# EasyEDA Pro project CCD传感器驱动板_DAC8311_ADS1118.eprj, schematic schematic1

## Sheets
1 power source: Create Date: 2025-03-25; Page Name: power source; Project Name: CCD传感器驱动板_DAC8311_ADS1118; Schematic Name: schematic1; Update Date: 2025-03-25; Company: 嘉立创EDA; Page Size: A4; Version: V1.0
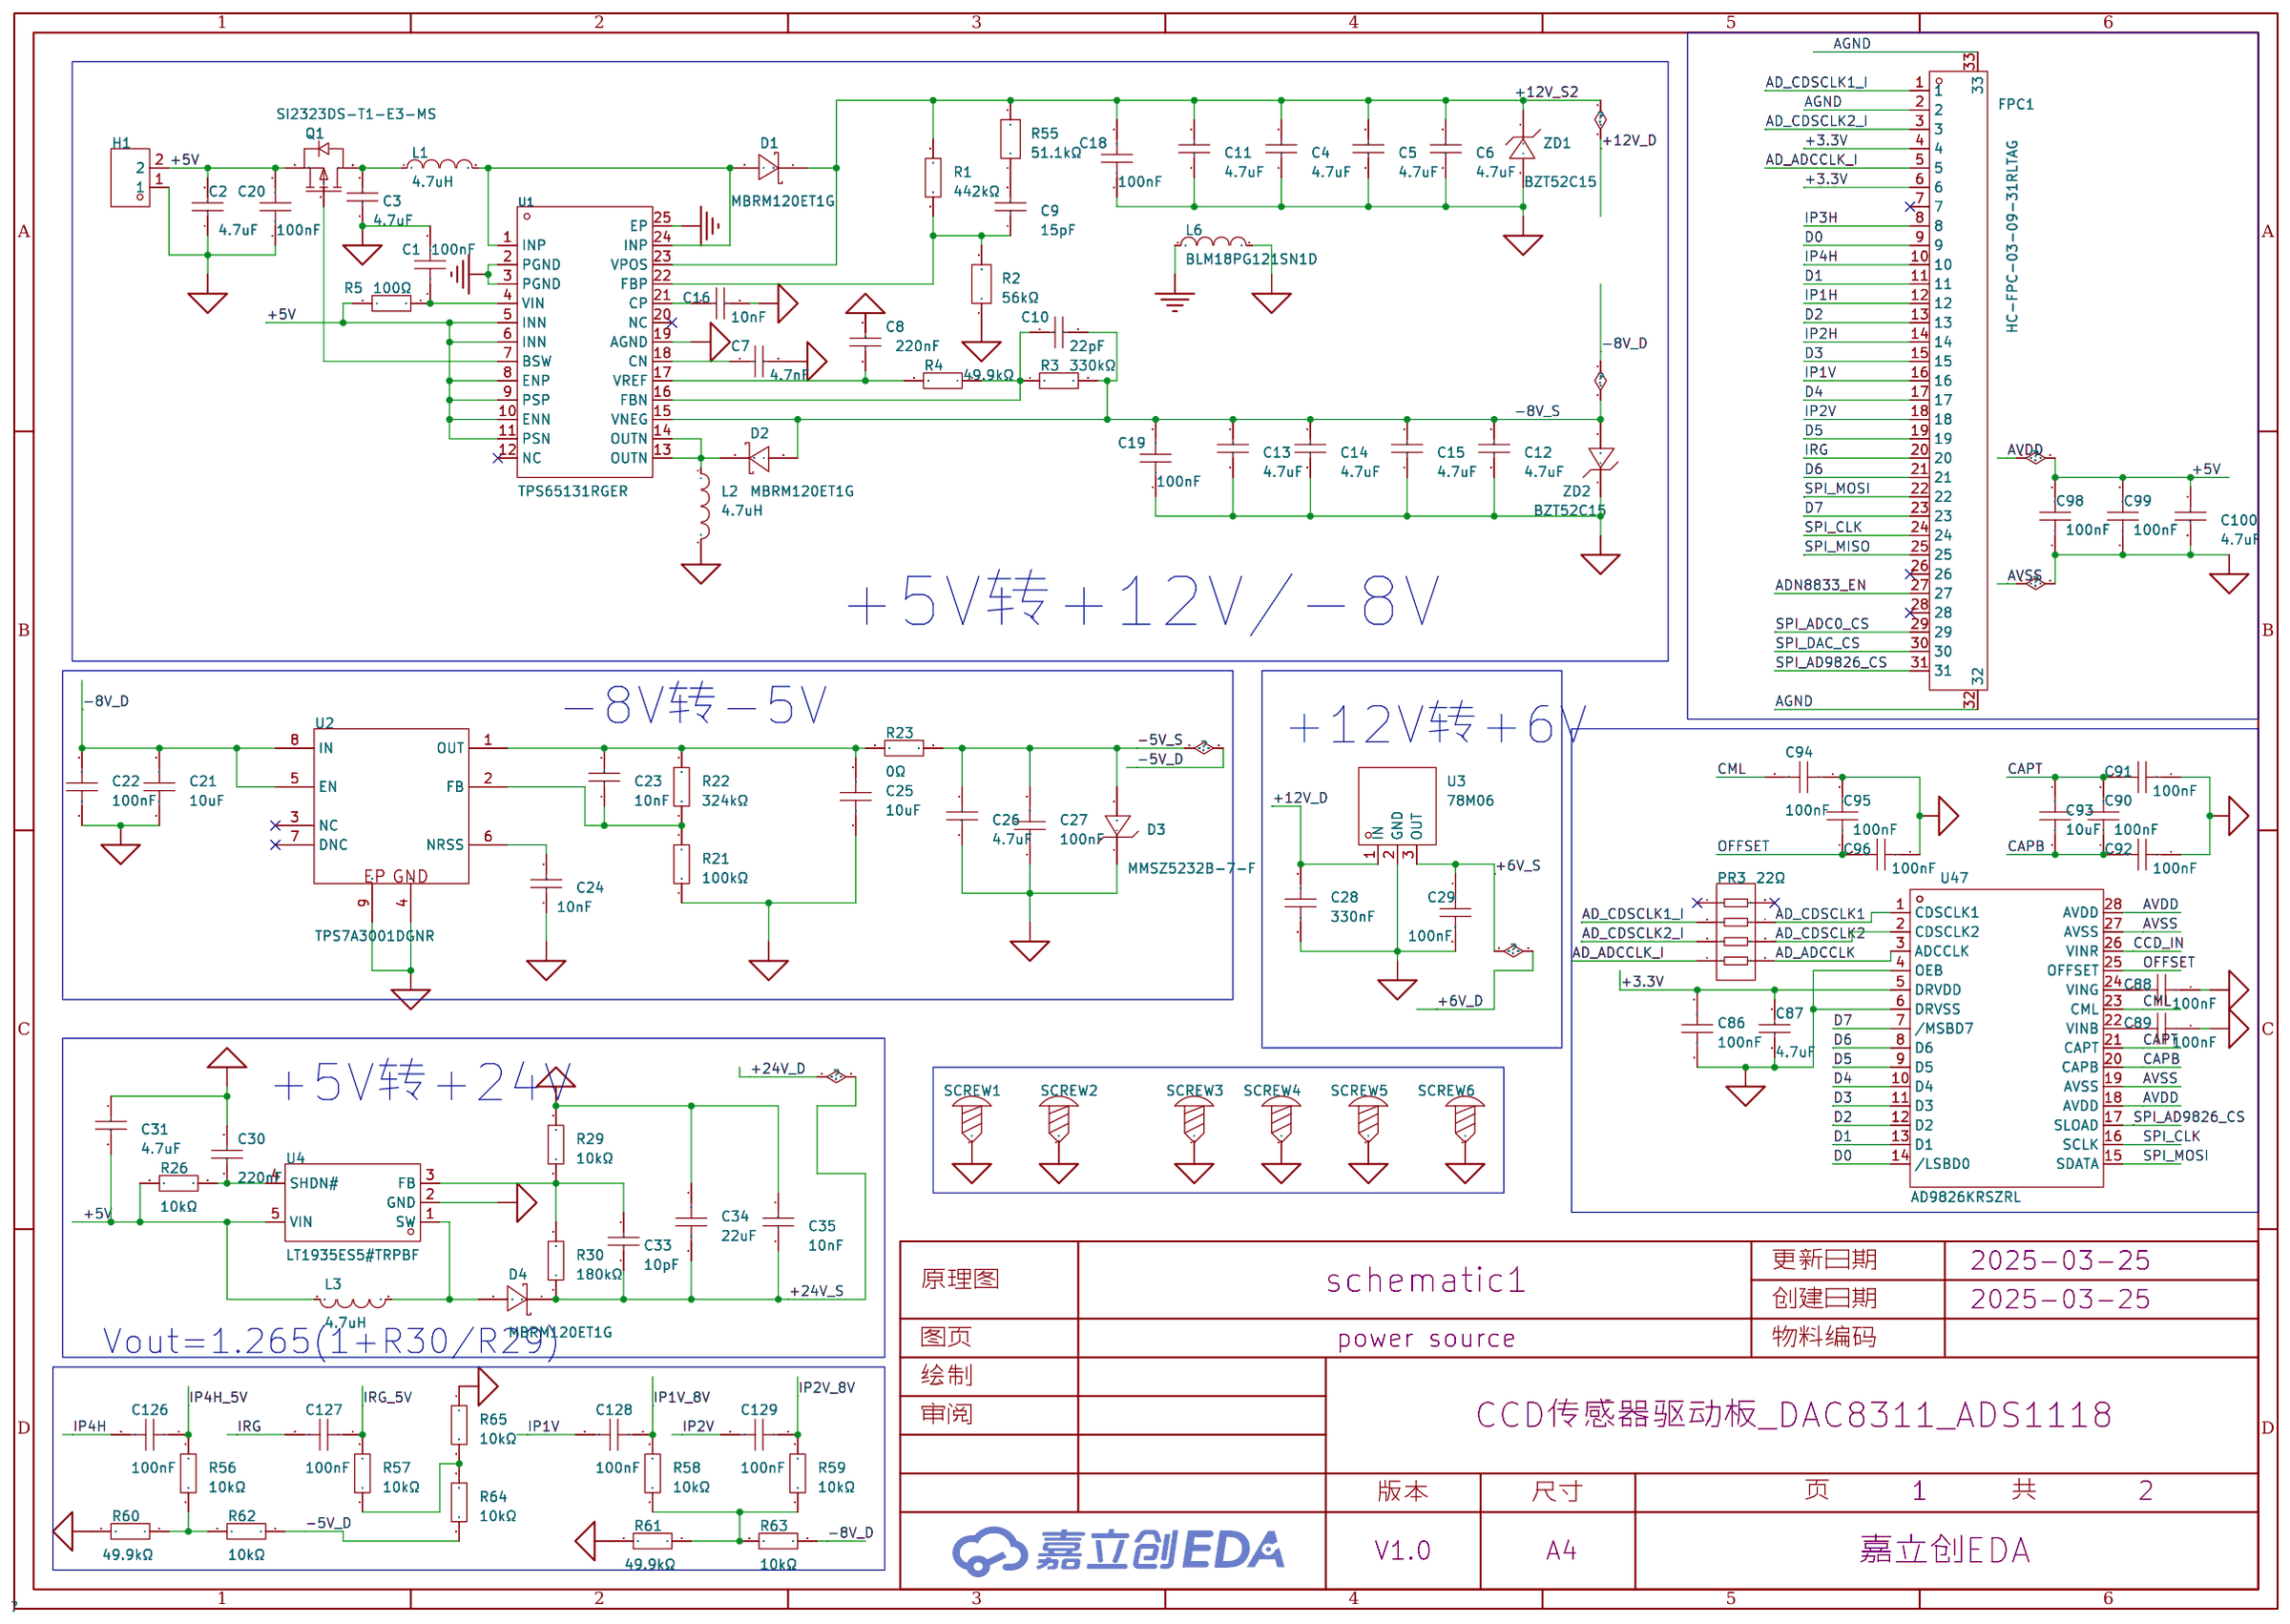
[diagram p0: power source]
2 electric convert: Page Name: electric convert; Update Date: 2025-03-26
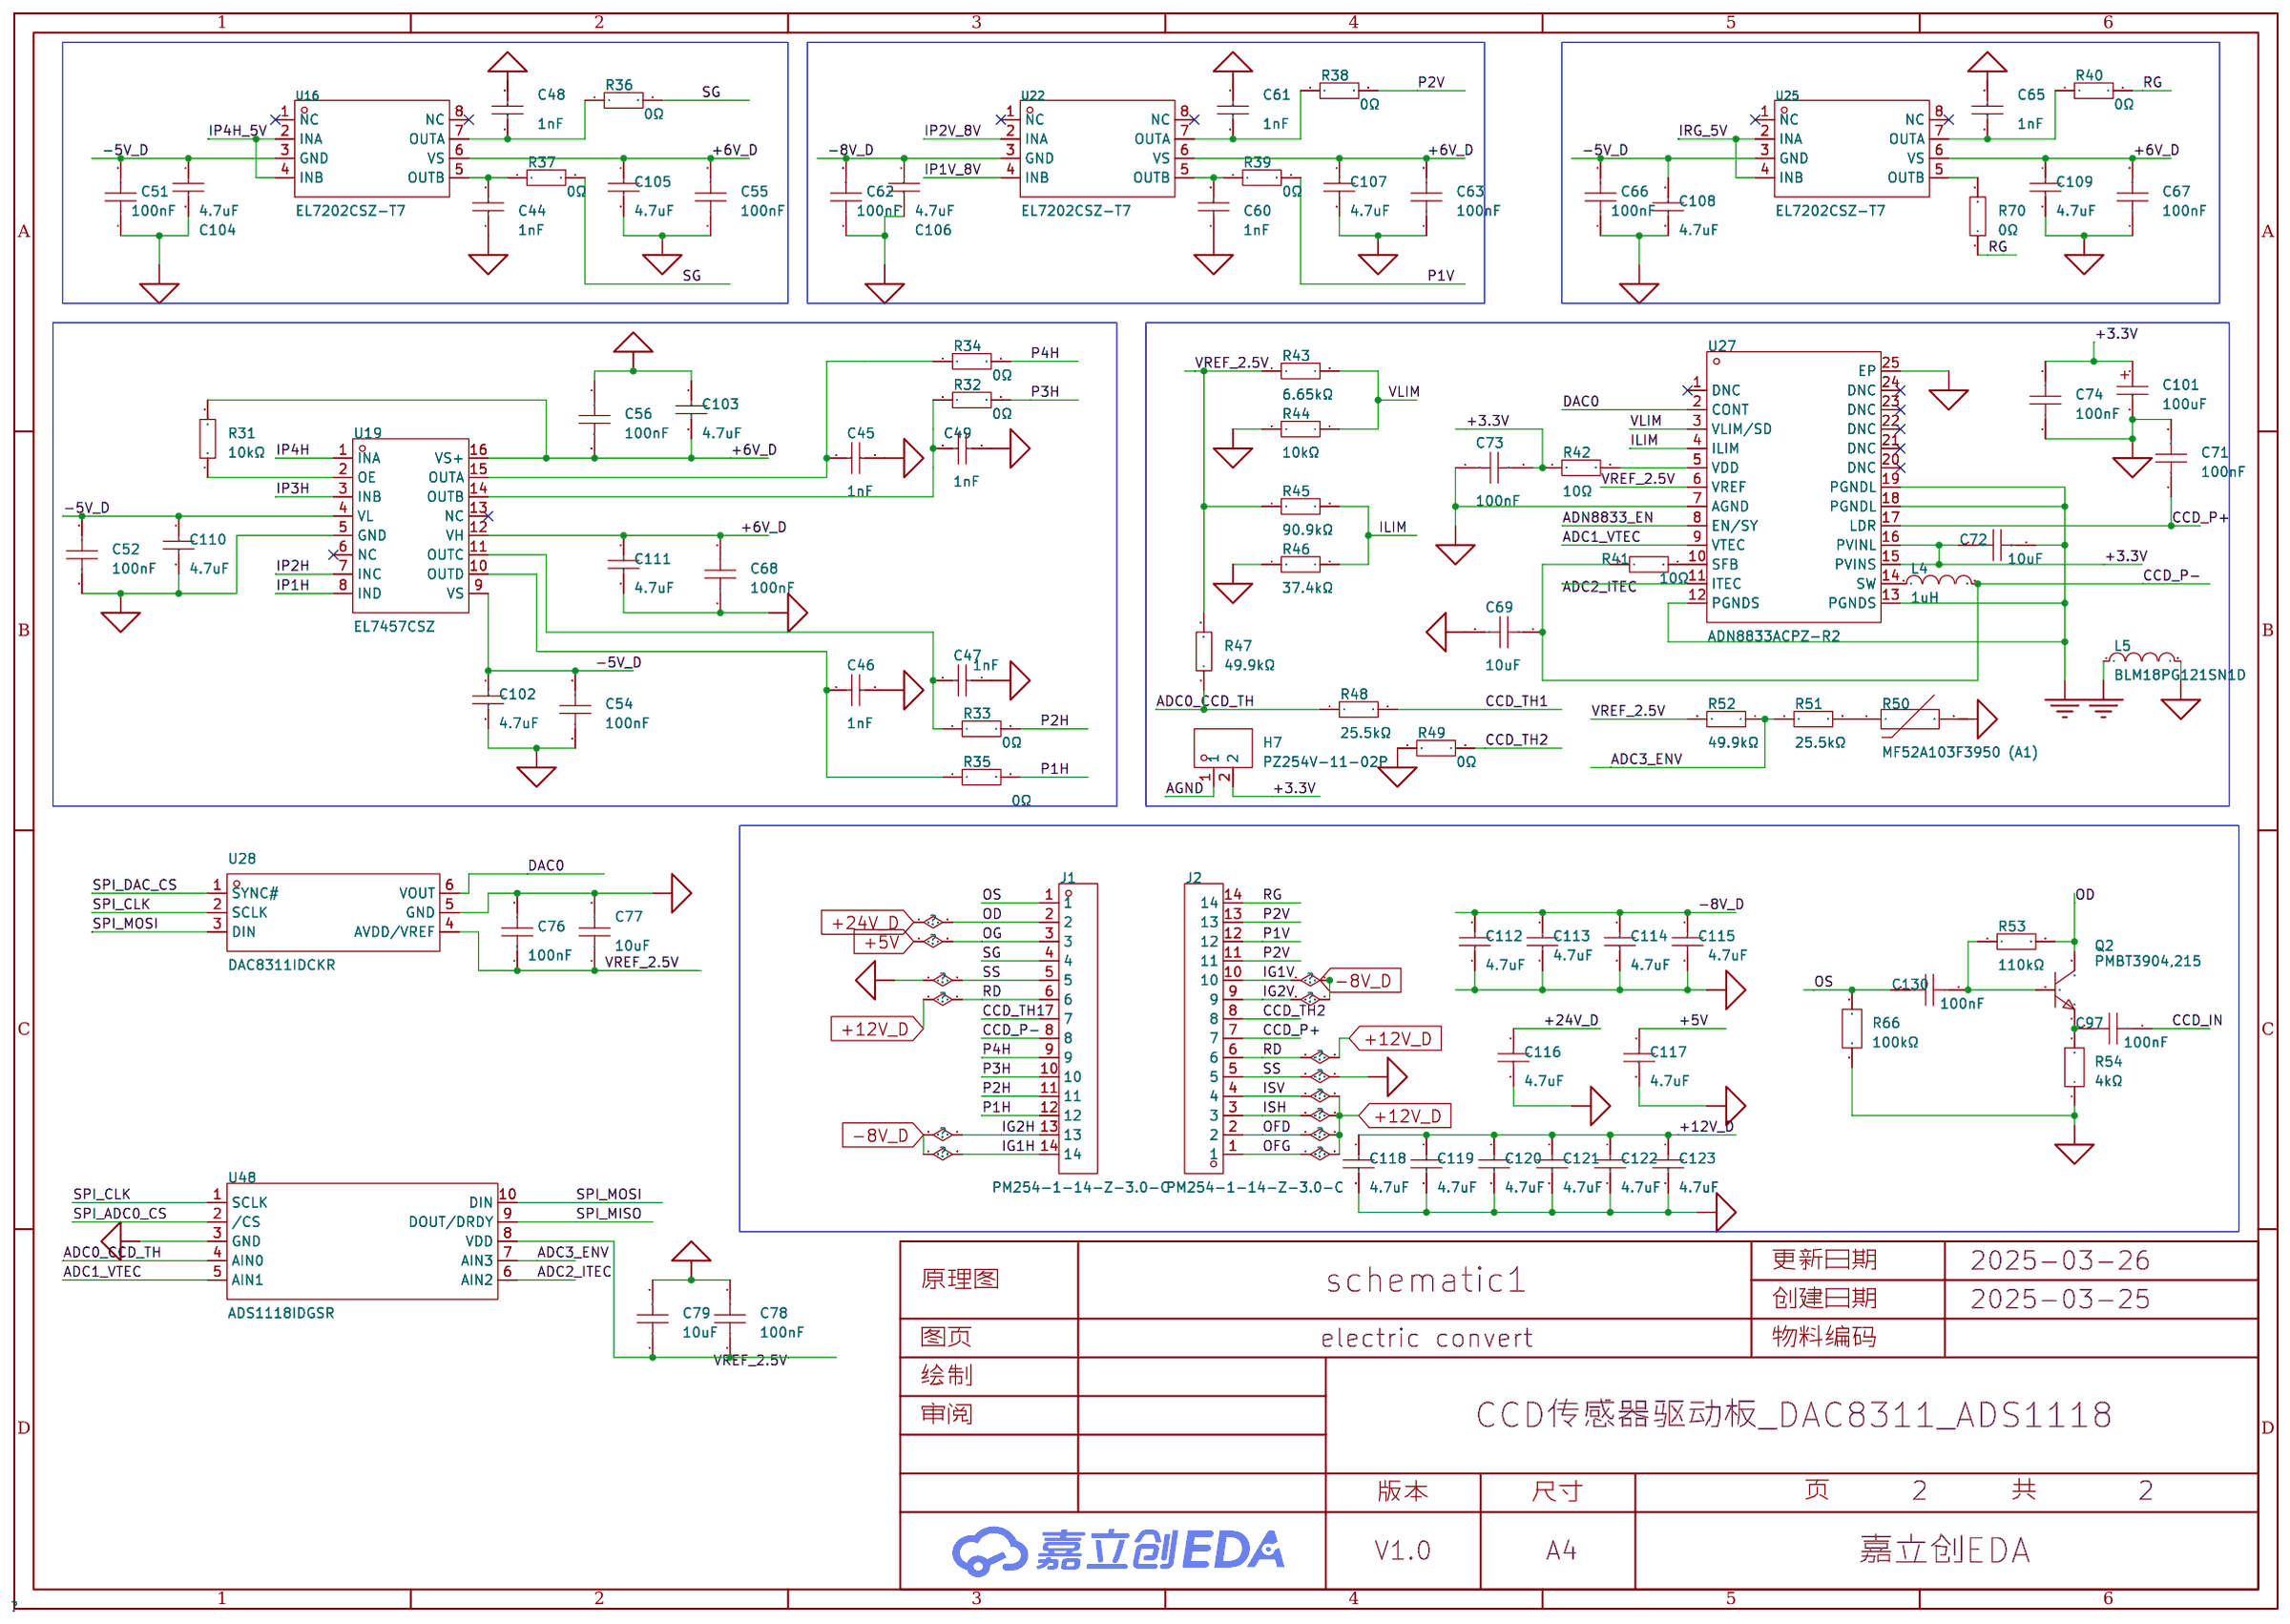
[diagram p1: electric convert]

## Parts
sheet electric convert
C44  1nF  [C0603]
C45  1nF  [C0603]
C46  1nF  [C0603]
C47  1nF  [C0603]
C48  1nF  [C0603]
C49  1nF  [C0603]
C51  100nF  [C0603]
C52  100nF  [C0603]
C54  100nF  [C0603]
C55  100nF  [C0603]
C56  100nF  [C0603]
C60  1nF  [C0603]
C61  1nF  [C0603]
C62  100nF  [C0603]
C63  100nF  [C0603]
C65  1nF  [C0603]
C66  100nF  [C0603]
C67  100nF  [C0603]
C68  100nF  [C0603]
C69  10uF  [C0603]
C71  100nF  [C0603]
C72  10uF  [C0603]
C73  100nF  [C0603]
C74  100nF  [C0603]
C76  100nF  [C0603]
C77  10uF  [C0603]
C78  100nF  [C0603]
C79  10uF  [C0603]
C97  100nF  [C0603]
C101  100uF  [CASE-B_3528]
C102  4.7uF  [C0603]
C103  4.7uF  [C0603]
C104  4.7uF  [C0603]
C105  4.7uF  [C0603]
C106  4.7uF  [C0603]
C107  4.7uF  [C0603]
C108  4.7uF  [C0603]
C109  4.7uF  [C0603]
C110  4.7uF  [C0603]
C111  4.7uF  [C0603]
C112  4.7uF  [C0603]
C113  4.7uF  [C0603]
C114  4.7uF  [C0603]
C115  4.7uF  [C0603]
C116  4.7uF  [C0603]
C117  4.7uF  [C0603]
C118  4.7uF  [C0603]
C119  4.7uF  [C0603]
C120  4.7uF  [C0603]
C121  4.7uF  [C0603]
C122  4.7uF  [C0603]
C123  4.7uF  [C0603]
C130  100nF  [C0603]
H7  PZ254V-11-02P  [HDR-TH_2P-P2.54-V-M]
J1  PM254-1-14-Z-3.0-C  [HDR-TH_14P-P2.54-V-F]
J2  PM254-1-14-Z-3.0-C  [HDR-TH_14P-P2.54-V-F]
L4  1uH  [L0603]
L5  BLM18PG121SN1D  [L0603]
Q2  PMBT3904,215  [SOT-23_L2.9-W1.3-P1.90-LS2.4-BR]
R31  10kΩ  [R0603]
R32  0Ω  [R0603]
R33  0Ω  [R0603]
R34  0Ω  [R0603]
R35  0Ω  [R0603]
R36  0Ω  [R0603]
R37  0Ω  [R0603]
R38  0Ω  [R0603]
R39  0Ω  [R0603]
R40  0Ω  [R0603]
R41  10Ω  [R0603]
R42  10Ω  [R0603]
R43  6.65kΩ  [R0603]
R44  10kΩ  [R0603]
R45  90.9kΩ  [R0603]
R46  37.4kΩ  [R0603]
R47  49.9kΩ  [R0603]
R48  25.5kΩ  [R0603]
R49  0Ω  [R0603]
R50  MF52A103F3950 (A1)  [RES-TH_L2.5-W2.5-P1.70-D0.3]
R51  25.5kΩ  [R0603]
R52  49.9kΩ  [R0603]
R53  110kΩ  [R0603]
R54  4kΩ  [R0603]
R66  100kΩ  [R0603]
R70  0Ω  [R0603]
U16  EL7202CSZ-T7  [SOIC-8_L4.9-W3.9-P1.27-LS6.0-BL]
U19  EL7457CSZ  [SOIC-16_L9.9-W3.9-P1.27-LS6.0-BL]
U22  EL7202CSZ-T7  [SOIC-8_L4.9-W3.9-P1.27-LS6.0-BL]
U25  EL7202CSZ-T7  [SOIC-8_L4.9-W3.9-P1.27-LS6.0-BL]
U27  ADN8833ACPZ-R2  [LFCSP-24_L4.0-W4.0-P0.50-BL-EP2.7]
U28  DAC8311IDCKR  [SC-70-6_L2.0-W1.3-P0.65-LS2.2-BL]
U48  ADS1118IDGSR  [VSSOP-10_L3.0-W3.0-P0.50-LS4.9-BL]
sheet power source
C1  100nF  [C0603]
C2  4.7uF  [C0603]
C3  4.7uF  [C0603]
C4  4.7uF  [C0603]
C5  4.7uF  [C0603]
C6  4.7uF  [C0603]
C7  4.7nF  [C0603]
C8  220nF  [C0603]
C9  15pF  [C0603]
C10  22pF  [C0603]
C11  4.7uF  [C0603]
C12  4.7uF  [C0603]
C13  4.7uF  [C0603]
C14  4.7uF  [C0603]
C15  4.7uF  [C0603]
C16  10nF  [C0603]
C18  100nF  [C0603]
C19  100nF  [C0603]
C20  100nF  [C0603]
C21  10uF  [C0603]
C22  100nF  [C0603]
C23  10nF  [C0603]
C24  10nF  [C0603]
C25  10uF  [C0603]
C26  4.7uF  [C0603]
C27  100nF  [C0603]
C28  330nF  [C0603]
C29  100nF  [C0603]
C30  220nF  [C0603]
C31  4.7uF  [C0603]
C33  10pF  [C0603]
C34  22uF  [C0603]
C35  10nF  [C0603]
C86  100nF  [C0603]
C87  4.7uF  [C0603]
C88  100nF  [C0603]
C89  100nF  [C0603]
C90  100nF  [C0603]
C91  100nF  [C0603]
C92  100nF  [C0603]
C93  10uF  [C0603]
C94  100nF  [C0603]
C95  100nF  [C0603]
C96  100nF  [C0603]
C98  100nF  [C0603]
C99  100nF  [C0603]
C100  4.7uF  [C0603]
C126  100nF  [C0603]
C127  100nF  [C0603]
C128  100nF  [C0603]
C129  100nF  [C0603]
D1  MBRM120ET1G  [POWERMITE_L2.0-W1.9-LS3.8-RD]
D2  MBRM120ET1G  [POWERMITE_L2.0-W1.9-LS3.8-RD]
D3  MMSZ5232B-7-F  [SOD-123_L2.8-W1.8-LS3.7-RD]
D4  MBRM120ET1G  [POWERMITE_L2.0-W1.9-LS3.8-RD]
FPC1  HC-FPC-03-09-31RLTAG  [FPC-SMD_31P-P0.30_HC-FPC-03-09-31RLTAG]
H1  PZ254V-11-02P  [HDR-TH_2P-P2.54-V-M]
L1  4.7uH  [IND-SMD_L5.5-W5.2]
L2  4.7uH  [IND-SMD_L5.5-W5.2]
L3  4.7uH  [IND-SMD_L5.5-W5.2]
L6  BLM18PG121SN1D  [L0603]
PR3  22Ω  [RES-ARRAY-SMD_0603-8P-L3.2-W1.6-BL]
Q1  SI2323DS-T1-E3-MS  [SOT-23-3_L2.9-W1.3-P1.90-LS2.4-BR]
R1  442kΩ  [R0603]
R2  56kΩ  [R0603]
R3  330kΩ  [R0603]
R4  49.9kΩ  [R0603]
R5  100Ω  [R0603]
R21  100kΩ  [R0603]
R22  324kΩ  [R0603]
R23  0Ω  [R0603]
R26  10kΩ  [R0603]
R29  10kΩ  [R0603]
R30  180kΩ  [R0603]
R55  51.1kΩ  [R0603]
R56  10kΩ  [R0603]
R57  10kΩ  [R0603]
R58  10kΩ  [R0603]
R59  10kΩ  [R0603]
R60  49.9kΩ  [R0603]
R61  49.9kΩ  [R0603]
R62  10kΩ  [R0603]
R63  10kΩ  [R0603]
R64  10kΩ  [R0603]
R65  10kΩ  [R0603]
SCREW1  -  [M2螺丝]
SCREW2  -  [M2螺丝]
SCREW3  -  [M3螺丝]
SCREW4  -  [M3螺丝]
SCREW5  -  [M3螺丝]
SCREW6  -  [M3螺丝]
U1  TPS65131RGER  [QFN-24_L4.0-W4.0-P0.50-TL-EP2.6]
U2  TPS7A3001DGNR  [HVSSOP-8_L3.0-W3.0-P0.65-LS4.9-BL-EP_1]
U3  78M06  [TO-252-3_L6.5-W5.8-P4.58-BL]
U4  LT1935ES5#TRPBF  [TSOT-23-5_L2.9-W1.6-P0.95-LS2.8-BR]
U47  AD9826KRSZRL  [SSOP-28_L10.2-W5.3-P0.65-LS7.8-BL]
ZD1  BZT52C15  [SOD-123_L2.8-W1.8-LS3.7-RD]
ZD2  BZT52C15  [SOD-123_L2.8-W1.8-LS3.7-RD]

## Library data of the parts
C44-C49 C60 C61 C65 = CL10B102KB8NNNC: 容值:1nF;精度:±10%;额定电压:50V;材质(温度系数):X7R;; LCSC Part Name: 1nF ±10% 50V; Supplier Part: C1588; Manufacturer: SAMSUNG(三星); Supplier Footprint: 0603; JLCPCB Part Class: 基础库; Datasheet: https://atta.szlcsc.com/upload/public/pdf/source/20160218/1457707763339.pdf; Supplier: LCSC; Tolerance: ±10%; Voltage Rated: 50V; Temperature Coefficient: X7R
C1 C18-C20 C22 C27 C29 C51 C52 C54-C56 C62 C63 C66-C68 C71 C73 C74 C76 C78 C86 C88-C92 C94-C99 C126-C130 = CL10B104KB8NNNC: 容值:100nF;精度:±10%;额定电压:50V;材质(温度系数):X7R;; LCSC Part Name: 100nF ±10% 50V; Supplier Part: C1591; Manufacturer: SAMSUNG(三星); Supplier Footprint: 0603; JLCPCB Part Class: 扩展库; Datasheet: https://atta.szlcsc.com/upload/public/pdf/source/20160218/1457707763339.pdf; Supplier: LCSC; Tolerance: ±10%; Voltage Rated: 50V; Temperature Coefficient: X7R
C21 C25 C69 C72 C77 C79 C93 = CL10A106MP8NNNC: 容值:10uF;精度:±20%;额定电压:10V;材质(温度系数):X5R;; LCSC Part Name: 10uF ±20% 10V; Supplier Part: C85713; Manufacturer: SAMSUNG(三星); Supplier Footprint: 0603; JLCPCB Part Class: 扩展库; Datasheet: https://atta.szlcsc.com/upload/public/pdf/source/20160218/1457707763339.pdf; Supplier: LCSC; Tolerance: ±20%; Voltage Rated: 10V; Temperature Coefficient: X5R
C101 = TAJB107K006RNJ: 容值:100uF;精度:±10%;额定电压:6.3V;等效串联电阻:1.7Ω@100kHz;; LCSC Part Name: 100uF ±10% 6.3V; Supplier Part: C16133; Manufacturer: Kyocera AVX; Supplier Footprint: CASE-B-3528-21(mm); JLCPCB Part Class: 基础库; Datasheet: https://atta.szlcsc.com/upload/public/pdf/source/20160107/1457707750344.pdf; Supplier: LCSC; Tolerance: ±10%; Rated Voltage: 6.3V; Equivalent Series Resistance(ESR): 1.7Ω@100kHz; Operating Temperature: -55℃~+125℃
C2-C6 C11-C15 C26 C31 C87 C100 C102-C123 = CL10A475KO8NNNC: 容值:4.7uF;精度:±10%;额定电压:16V;材质(温度系数):X5R;; LCSC Part Name: 4.7uF ±10% 16V; Supplier Part: C19666; Manufacturer: SAMSUNG(三星); Supplier Footprint: 0603; JLCPCB Part Class: 基础库; Datasheet: https://atta.szlcsc.com/upload/public/pdf/source/20160218/1457707763339.pdf; Supplier: LCSC; Tolerance: ±10%; Voltage Rated: 16V; Temperature Coefficient: X5R
H1 H7 = PZ254V-11-02P: 插针结构:1x2P;间距:2.54mm;行距:-;圆针/方针:方针;安装类型:直插;排数:单排;总PIN位数:2P;额定电流:-;额定电压:-;配合针长度:6mm;塑高:2.5mm;端接针长度:3mm;触头材质:黄铜;触头镀层:-;工作温度范围:-40℃~+105℃;颜色:黑色;; LCSC Part Name: 间距:2.54mm 1x2P 直插 方针; Supplier Part: C492401; Manufacturer: XFCN(兴飞); Supplier Footprint: 插件,P=2.54mm; JLCPCB Part Class: 扩展库; Datasheet: https://atta.szlcsc.com/upload/public/pdf/source/20200309/C492401_A812433581A9B211A7FFA413ADDFF0E5.pdf; Supplier: LCSC; Pin Structure: 1x2P; Pitch: 2.54mm; Circluar Pins/Square Pins: 方针; Mounting Type: 直插; Number of Rows: 单排; Number of Pins: 2P; Length of Mating Pin: 6mm; Insulation Height: 2.5mm; Length of End Connection Pin: 3mm; Contact Material: 黄铜; Operating Temperature Range: -40℃~+105℃; Color: 黑色
J1 J2 = PM254-1-14-Z-3.0-C: 插孔结构:1x14P;间距:2.54mm;行距:-;圆孔/方孔:圆孔;安装类型:直插;排数:单排;总孔位数:14P;额定电流:3A;插孔方向:顶部;塑高:3mm;触头材质:黄铜;触头镀层:金;工作温度范围:-40℃~+105℃;焊接温度(最大值):260℃@10S;; LCSC Part Name: 1x14P 间距:2.54mm 直插; Supplier Part: C5156452; Manufacturer: HCTL(华灿天禄); Supplier Footprint: 插件,P=2.54mm; Datasheet: https://atta.szlcsc.com/upload/public/pdf/source/20230609/3F35CA450E3E74609FC35AAE8B198FCB.pdf; Supplier: LCSC; Holes Structure: 1x14P; Pitch: 2.54mm; Circular Hole / Square Hole: 圆孔; Mounting Type: 直插; Number of Rows: 单排; Number of Holes: 14P; Current Rating (Max): 3A; Holes Direction: 顶部; Insulation Height: 3mm; Contact Material: 黄铜; Contact Plating: 金; Operating Temperature Range: -40℃~+105℃; Soldering Temperature(Max): 260℃@10S
L4 = LQM18PN1R0MFRL: 电感值:1uH;精度:±20%;额定电流:950mA;饱和电流(Isat):-;直流电阻(DCR):200mΩ;; LCSC Part Name: 1uH ±20%; Supplier Part: C307603; Manufacturer: muRata(村田); Supplier Footprint: 0603; JLCPCB Part Class: 扩展库; Datasheet: https://atta.szlcsc.com/upload/public/pdf/source/20181116/C307603_C4EDA09A2B1B4899E599C63ECAEC2B9D.pdf; Supplier: LCSC; Tolerance: ±20%; Rated Current: 950mA; DC Resistance (DCR): 200mΩ; Frequency - Self Resonant: 100MHz
L5 L6 = BLM18PG121SN1D: 标称阻抗@测试频率:120Ω@100MHz;误差:±25%;直流电阻(RDC):50mΩ;; LCSC Part Name: 单路 0603磁珠 阻抗120Ω@100MHz; Supplier Part: C14709; Manufacturer: muRata(村田); Supplier Footprint: 0603; JLCPCB Part Class: 扩展库; Datasheet: https://atta.szlcsc.com/upload/public/pdf/source/20130704/1457706621422.pdf; Supplier: LCSC; Impedance @ Frequency: 120Ω@100MHz; Tolerance: ±25%; DC Resistance: 50mΩ; Current Rating: 2A; Circuits: 1
Q2 = PMBT3904,215: 晶体管类型:NPN;集电极电流(Ic):200mA;集射极击穿电压(Vceo):40V;功率(Pd):250mW;直流电流增益(hFE@Ic,Vce):100@10mA,1V;; LCSC Part Name: NPN 电流:200mA 耐压:40V; Supplier Part: C8667; Manufacturer: Nexperia(安世); Supplier Footprint: SOT-23; JLCPCB Part Class: 扩展库; Datasheet: https://atta.szlcsc.com/upload/public/pdf/source/20210520/C8667_82CC4B18F957EC74ED6E8B4E120941E6.pdf; Supplier: LCSC; Transistor Type: NPN; Collector Current (Ic): 200mA; Collector-Emitter Breakdown Voltage (Vceo): 40V; Power Dissipation (Pd): 250mW; DC Current Gain (hFE@Ic,Vce): 100@10mA,1V; Transition Frequency (fT): 300MHz; Collector Cut-Off Current (Icbo): 50nA; Collector-Emitter Saturation Voltage (VCE(sat)@Ic,Ib): 300mV@50mA,5mA
R26 R29 R31 R44 R56-R59 R62-R65 = 0603WAF1002T5E: 电阻类型:厚膜电阻;阻值:10kΩ;精度:±1%;功率:100mW;最大工作电压:75V;温度系数:±100ppm/℃;; LCSC Part Name: 厚膜电阻 10kΩ ±1% 100mW; Supplier Part: C25804; Manufacturer: UNI-ROYAL(厚声); Supplier Footprint: 0603; JLCPCB Part Class: 基础库; Datasheet: https://atta.szlcsc.com/upload/public/pdf/source/20200306/C422600_1E6D84923E4A46A82E41ADD87F860B5C.pdf; Supplier: LCSC; Type: 厚膜电阻; Tolerance: ±1%; Power(Watts): 100mW; Overload Voltage (Max): 75V; Temperature Coefficient: ±100ppm/℃; Operating Temperature Range: -55℃~+155℃
R23 R32-R40 R49 R70 = 0603WAF0000T5E: 电阻类型:厚膜电阻;阻值:0Ω;精度:±1%;功率:100mW;最大工作电压:75V;; LCSC Part Name: 0Ω ±1% 100mW 厚膜电阻; Supplier Part: C21189; Manufacturer: UNI-ROYAL(厚声); Supplier Footprint: 0603; JLCPCB Part Class: 基础库; Datasheet: https://atta.szlcsc.com/upload/public/pdf/source/20200306/C422600_1E6D84923E4A46A82E41ADD87F860B5C.pdf; Supplier: LCSC; Type: 厚膜电阻; Tolerance: ±1%; Power(Watts): 100mW; Overload Voltage (Max): 75V; Operating Temperature Range: -55℃~+155℃
R41 R42 = 0603WAF100JT5E: 电阻类型:厚膜电阻;阻值:10Ω;精度:±1%;功率:100mW;最大工作电压:75V;温度系数:±400ppm/℃;; LCSC Part Name: 10Ω ±1% 100mW 厚膜电阻; Supplier Part: C22859; Manufacturer: UNI-ROYAL(厚声); Supplier Footprint: 0603; JLCPCB Part Class: 基础库; Datasheet: https://atta.szlcsc.com/upload/public/pdf/source/20200306/C422600_1E6D84923E4A46A82E41ADD87F860B5C.pdf; Supplier: LCSC; Type: 厚膜电阻; Tolerance: ±1%; Power(Watts): 100mW; Overload Voltage (Max): 75V; Temperature Coefficient: ±400ppm/℃; Operating Temperature Range: -55℃~+155℃
R43 = 0603WAF6651T5E: 电阻类型:厚膜电阻;阻值:6.65kΩ;精度:±1%;功率:100mW;最大工作电压:75V;温度系数:±100ppm/℃;; LCSC Part Name: 6.65kΩ ±1% 100mW 厚膜电阻; Supplier Part: C60344; Manufacturer: UNI-ROYAL(厚声); Supplier Footprint: 0603; JLCPCB Part Class: 扩展库; Datasheet: https://atta.szlcsc.com/upload/public/pdf/source/20200306/C422600_1E6D84923E4A46A82E41ADD87F860B5C.pdf; Supplier: LCSC; Type: 厚膜电阻; Tolerance: ±1%; Power(Watts): 100mW; Overload Voltage (Max): 75V; Temperature Coefficient: ±100ppm/℃; Operating Temperature Range: -55℃~+155℃
R45 = 0603WAF9092T5E: 电阻类型:厚膜电阻;阻值:90.9kΩ;精度:±1%;功率:100mW;最大工作电压:75V;温度系数:±100ppm/℃;; LCSC Part Name: 90.9kΩ ±1% 100mW 厚膜电阻; Supplier Part: C23129; Manufacturer: UNI-ROYAL(厚声); Supplier Footprint: 0603; JLCPCB Part Class: 扩展库; Datasheet: https://atta.szlcsc.com/upload/public/pdf/source/20200306/C422600_1E6D84923E4A46A82E41ADD87F860B5C.pdf; Supplier: LCSC; Type: 厚膜电阻; Tolerance: ±1%; Power(Watts): 100mW; Overload Voltage (Max): 75V; Temperature Coefficient: ±100ppm/℃; Operating Temperature Range: -55℃~+155℃
R46 = 0603WAF3742T5E: 电阻类型:厚膜电阻;阻值:37.4kΩ;精度:±1%;功率:100mW;最大工作电压:75V;温度系数:±100ppm/℃;; LCSC Part Name: 37.4kΩ ±1% 100mW 厚膜电阻; Supplier Part: C23033; Manufacturer: UNI-ROYAL(厚声); Supplier Footprint: 0603; JLCPCB Part Class: 扩展库; Datasheet: https://atta.szlcsc.com/upload/public/pdf/source/20200306/C422600_1E6D84923E4A46A82E41ADD87F860B5C.pdf; Supplier: LCSC; Type: 厚膜电阻; Tolerance: ±1%; Power(Watts): 100mW; Overload Voltage (Max): 75V; Temperature Coefficient: ±100ppm/℃; Operating Temperature Range: -55℃~+155℃
R4 R47 R52 R60 R61 = 0603WAF4992T5E: 电阻类型:厚膜电阻;阻值:49.9kΩ;精度:±1%;功率:100mW;最大工作电压:75V;温度系数:±100ppm/℃;; LCSC Part Name: 49.9kΩ ±1% 100mW 厚膜电阻; Supplier Part: C23184; Manufacturer: UNI-ROYAL(厚声); Supplier Footprint: 0603; JLCPCB Part Class: 基础库; Datasheet: https://atta.szlcsc.com/upload/public/pdf/source/20200306/C422600_1E6D84923E4A46A82E41ADD87F860B5C.pdf; Supplier: LCSC; Type: 厚膜电阻; Tolerance: ±1%; Power(Watts): 100mW; Overload Voltage (Max): 75V; Temperature Coefficient: ±100ppm/℃; Operating Temperature Range: -55℃~+155℃
R48 R51 = 0603WAF2552T5E: 电阻类型:厚膜电阻;阻值:25.5kΩ;精度:±1%;功率:100mW;最大工作电压:75V;温度系数:±100ppm/℃;; LCSC Part Name: 25.5kΩ ±1% 100mW 厚膜电阻; Supplier Part: C22920; Manufacturer: UNI-ROYAL(厚声); Supplier Footprint: 0603; JLCPCB Part Class: 扩展库; Datasheet: https://atta.szlcsc.com/upload/public/pdf/source/20200306/C422600_1E6D84923E4A46A82E41ADD87F860B5C.pdf; Supplier: LCSC; Type: 厚膜电阻; Tolerance: ±1%; Power(Watts): 100mW; Overload Voltage (Max): 75V; Temperature Coefficient: ±100ppm/℃; Operating Temperature Range: -55℃~+155℃
R50 = MF52A103F3950 (A1): 阻值(25℃):10kΩ;B值(25℃/50℃):3950K;电阻精度:±1%;功率:50mW;B值精度:±1%;最大稳态电流(25℃):-;; LCSC Part Name: 10kΩ 电阻精度:±1% 3950K; Supplier Part: C13879; Manufacturer: 时恒; Supplier Footprint: 插件,P=1.7mm; JLCPCB Part Class: 扩展库; Datasheet: https://atta.szlcsc.com/upload/public/pdf/source/20181018/C324070_6015F64EA824A635FDB9BBFA1E1FD5FE.pdf; Supplier: LCSC; Resistance @ 25℃: 10kΩ; B Constant (25℃/50℃): 3950K; Resistance Tolerance: ±1%; Power: 50mW; B Constant Tolerance: ±1%; Operating Temperature: -55℃~+125℃
R53 = 0603WAF1103T5E: 电阻类型:厚膜电阻;阻值:110kΩ;精度:±1%;功率:100mW;最大工作电压:75V;温度系数:±100ppm/℃;; LCSC Part Name: 110kΩ ±1% 100mW 厚膜电阻; Supplier Part: C25805; Manufacturer: UNI-ROYAL(厚声); Supplier Footprint: 0603; JLCPCB Part Class: 扩展库; Datasheet: https://atta.szlcsc.com/upload/public/pdf/source/20200306/C422600_1E6D84923E4A46A82E41ADD87F860B5C.pdf; Supplier: LCSC; Type: 厚膜电阻; Tolerance: ±1%; Power(Watts): 100mW; Overload Voltage (Max): 75V; Temperature Coefficient: ±100ppm/℃; Operating Temperature Range: -55℃~+155℃
R54 = ARG03FTC4001N: 电阻类型:薄膜电阻;阻值:4kΩ;精度:±1%;; LCSC Part Name: 4kΩ ±1%; Supplier Part: C2984443; Manufacturer: Viking(光颉); Supplier Footprint: 0603; JLCPCB Part Class: 扩展库; Datasheet: https://atta.szlcsc.com/upload/public/pdf/source/20200117/C485675_99063924B4564AF910B7BE66DA8EFA49.pdf; Supplier: LCSC; Type: 薄膜电阻; Tolerance: ±1%
R66 = 0603WAD1003T5E: 电阻类型:厚膜电阻;阻值:100kΩ;精度:±0.5%;功率:100mW;最大工作电压:75V;温度系数:±100ppm/℃;; LCSC Part Name: 100kΩ ±0.5% 100mW 厚膜电阻; Supplier Part: C423093; Manufacturer: UNI-ROYAL(厚声); Supplier Footprint: 0603; JLCPCB Part Class: 扩展库; Datasheet: https://atta.szlcsc.com/upload/public/pdf/source/20200102/C423413_58AC64FF5730584578C10BF0002471B1.pdf; Supplier: LCSC; Type: 厚膜电阻; Tolerance: ±0.5%; Power(Watts): 100mW; Overload Voltage (Max): 75V; Temperature Coefficient: ±100ppm/℃; Operating Temperature Range: -55℃~+155℃
U16 U22 U25 = EL7202CSZ-T7: 驱动配置:低边;负载类型:MOSFET;驱动通道数:2;峰值灌电流:2A;峰值拉电流:2A;电源电压:4.5V~15V;上升时间:7.5ns;下降时间:10ns;; Supplier Part: C105899; Manufacturer: RENESAS(瑞萨)/IDT; Supplier Footprint: SOIC-8; JLCPCB Part Class: 扩展库; Datasheet: https://atta.szlcsc.com/upload/public/pdf/source/20180126/C105899_15169557863221308825.pdf; Supplier: LCSC; Driven Configuration: 低边; Load Type: MOSFET; Number of Drivers: 2; Peak Output Current(sink): 2A; Peak Output Current(source): 2A; Supply Voltage: 4.5V~15V; Rise Time: 7.5ns; Fall Time: 10ns; Operating Temperature: -40℃~+125℃@(Tj)
U19 = EL7457CSZ: 驱动配置:低边；高边;负载类型:MOSFET;驱动通道数:4;峰值灌电流:2A;峰值拉电流:2A;电源电压:4.5V~18V;上升时间:13.5ns;下降时间:13ns;; Supplier Part: C3655423; Manufacturer: RENESAS(瑞萨)/IDT; Supplier Footprint: SOIC-16; JLCPCB Part Class: 扩展库; Supplier: LCSC; Driven Configuration: 低边；高边; Load Type: MOSFET; Number of Drivers: 4; Peak Output Current(sink): 2A; Peak Output Current(source): 2A; Supply Voltage: 4.5V~18V; Rise Time: 13.5ns; Fall Time: 13ns; Operating Temperature: -40℃~+85℃@(Ta)
U27 = ADN8833ACPZ-R2: Supplier Part: C579233; Manufacturer: ADI(亚德诺); Supplier Footprint: LFCSP-24(4x4); JLCPCB Part Class: 扩展库; Datasheet: https://atta.szlcsc.com/upload/public/pdf/source/20200316/C496501_327FFF815D62302F0AF4588739029AFE.pdf; Supplier: LCSC
U28 = DAC8311IDCKR: 接口:DSP；SPI;电源电压:2V~5.5V;分辨率:14位;INL/DNL:±1LSB；±0.125LSB;稳定时间:10us;; Supplier Part: C2679469; Manufacturer: TI(德州仪器); Supplier Footprint: SC-70-6; Datasheet: https://www.ti.com/cn/lit/gpn/dac8411; Supplier: LCSC; Interface: DSP；SPI; Output Type: 电压-缓冲; Supply Voltage: 2V~5.5V; Resolution: 14位; Integral nonlinearity: ±1LSB；±0.125LSB; Settling Time: 10us; Operating Temperature: -40℃~+125℃
U48 = ADS1118IDGSR: 接口:SPI;电源电压:2V~5.5V;采样率:860Hz;分辨率:16位;; Supplier Part: C55347; Manufacturer: TI(德州仪器); Supplier Footprint: VSSOP-10-0.5mm; Datasheet: https://www.ti.com/cn/lit/gpn/ads1118; Supplier: LCSC; Interface: SPI; differential input: 是; number of channels: 4; Supply Voltage: 2V~5.5V; Integral nonlinearity: 2LSB; sampling frequency: 860Hz; resolution: 16位; Operating Temperature: -40℃~+125℃
C7 = GRM1885C1H472JA01D: 容值:4.7nF;精度:±5%;额定电压:50V;材质(温度系数):C0G;; LCSC Part Name: 4.7nF ±5% 50V; Supplier Part: C85980; Manufacturer: muRata(村田); Supplier Footprint: 0603; Datasheet: https://atta.szlcsc.com/upload/public/pdf/source/20200305/C490387_23319AE8C154DEB24C505E6C82A8106A.pdf; Supplier: LCSC; Tolerance: ±5%; Voltage Rated: 50V; Temperature Coefficient: C0G
C8 C30 = CL10B224KA8NNNC: 容值:220nF;精度:±10%;额定电压:25V;材质(温度系数):X7R;; LCSC Part Name: 220nF ±10% 25V; Supplier Part: C21120; Manufacturer: SAMSUNG(三星); Supplier Footprint: 0603; JLCPCB Part Class: 基础库; Datasheet: https://atta.szlcsc.com/upload/public/pdf/source/20160218/1457707763339.pdf; Supplier: LCSC; Tolerance: ±10%; Voltage Rated: 25V; Temperature Coefficient: X7R
C9 = CL10C150JB8NNNC: 容值:15pF;精度:±5%;额定电压:50V;材质(温度系数):C0G;; LCSC Part Name: 15pF ±5% 50V; Supplier Part: C1644; Manufacturer: SAMSUNG(三星); Supplier Footprint: 0603; Datasheet: https://atta.szlcsc.com/upload/public/pdf/source/20160218/1457707763339.pdf; Supplier: LCSC; Tolerance: ±5%; Voltage Rated: 50V; Temperature Coefficient: C0G
C10 = CL10C220JB8NNNC: 容值:22pF;精度:±5%;额定电压:50V;材质(温度系数):C0G;; LCSC Part Name: 22pF ±5% 50V; Supplier Part: C1653; Manufacturer: SAMSUNG(三星); Supplier Footprint: 0603; Datasheet: https://atta.szlcsc.com/upload/public/pdf/source/20160218/1457707763339.pdf; Supplier: LCSC; Tolerance: ±5%; Voltage Rated: 50V; Temperature Coefficient: C0G
C16 C23 C24 C35 = CL10B103KB8NNNC: 容值:10nF;精度:±10%;额定电压:50V;材质(温度系数):X7R;; LCSC Part Name: 10nF ±10% 50V; Supplier Part: C1589; Manufacturer: SAMSUNG(三星); Supplier Footprint: 0603; JLCPCB Part Class: 扩展库; Datasheet: https://atta.szlcsc.com/upload/public/pdf/source/20160218/1457707763339.pdf; Supplier: LCSC; Tolerance: ±10%; Voltage Rated: 50V; Temperature Coefficient: X7R
C28 = GCJ188R91E334KA01D: 容值:330nF;精度:±10%;额定电压:25V;材质(温度系数):X8R;; LCSC Part Name: 330nF ±10% 25V; Supplier Part: C354382; Manufacturer: muRata(村田); Supplier Footprint: 0603; JLCPCB Part Class: 扩展库; Datasheet: https://atta.szlcsc.com/upload/public/pdf/source/20190214/C354382_32EEDBE6D9FB03F0DA2BCA9D21BB53A7.pdf; Supplier: LCSC; Tolerance: ±10%; Voltage Rated: 25V; Temperature Coefficient: X8R
C33 = CL10C100JB8NNNC: 容值:10pF;精度:±5%;额定电压:50V;材质(温度系数):C0G;; LCSC Part Name: 10pF ±5% 50V; Supplier Part: C1634; Manufacturer: SAMSUNG(三星); Supplier Footprint: 0603; JLCPCB Part Class: 基础库; Datasheet: https://atta.szlcsc.com/upload/public/pdf/source/20160218/1457707763339.pdf; Supplier: LCSC; Tolerance: ±5%; Voltage Rated: 50V; Temperature Coefficient: C0G
C34 = CL10A226MO7JZNC: 容值:22uF;精度:±20%;额定电压:16V;材质(温度系数):X5R;; LCSC Part Name: 22uF ±20% 16V; Supplier Part: C2762594; Manufacturer: SAMSUNG(三星); Supplier Footprint: 0603; JLCPCB Part Class: 扩展库; Datasheet: https://atta.szlcsc.com/upload/public/pdf/source/20220811/0832C3B1C642040B023B7A6186895861.pdf; Supplier: LCSC; Tolerance: ±20%; Voltage Rated: 16V; Temperature Coefficient: X5R
D1 D2 D4 = MBRM120ET1G: 正向压降(Vf):530mV@1A;直流反向耐压(Vr):20V;平均整流电流(Io):1A;; LCSC Part Name: 电压:20V 电流:1A; Supplier Part: C152484; Manufacturer: onsemi(安森美); Supplier Footprint: DO-216AA; JLCPCB Part Class: 扩展库; Datasheet: https://atta.szlcsc.com/upload/public/pdf/source/20180112/C154780_15157258186551261654.PDF; Supplier: LCSC; Forward Voltage (Vf@If): 530mV@1A; Reverse Voltage (Vr): 20V; Average Rectified Current (Io): 1A; Reverse Leakage Current (Ir): 10uA@20V
D3 = MMSZ5232B-7-F: 二极管配置:独立式;稳压值(标称值):5.6V;稳压值(范围):5.32V~5.88V;功率:500mW;精度:±5%;; Supplier Part: C156265; Manufacturer: DIODES(美台); Supplier Footprint: SOD-123; JLCPCB Part Class: 扩展库; Datasheet: https://atta.szlcsc.com/upload/public/pdf/source/20191127/C460920_E7CC40613EA597B3A744838D1930563D.pdf; Supplier: LCSC; Diode Configuration: 独立式; Zener Voltage (Nom): 5.6V; Reverse Leakage Current (Ir): 5uA@3V; Zener Voltage (Range): 5.32V~5.88V; Power Dissipation: 500mW; Zener Impedance (Zzt): 11Ω; Tolerance: ±5%
FPC1 = HC-FPC-03-09-31RLTAG: 锁定特性:翻盖式;触点类型:下接;触点数量:31P;间距:0.3mm;安装类型:卧贴;工作温度范围:-55℃~+85℃;; LCSC Part Name: 翻盖式 下接 P数:31P 间距:0.3mm; Supplier Part: C5213720; Manufacturer: HCTL(华灿天禄); Supplier Footprint: SMD,P=0.3mm,卧贴; JLCPCB Part Class: 扩展库; Datasheet: https://atta.szlcsc.com/upload/public/pdf/source/20221026/55116F00BFC22157751B107FB75AF04D.pdf; Supplier: LCSC; Locking Feature: 翻盖式; Contact Type: 下接; Number of Contacts: 31P; Pitch: 0.3mm; Mounting Type: 卧贴; FFC, FCB Thickness: 0.2mm; Height Above Board: 1mm; Contact Material: 磷青铜; Operating Temperature Range: -55℃~+85℃
L1-L3 = SMMS0530-4R7M: 电感值:4.7uH;精度:±20%;额定电流:4.5A;饱和电流(Isat):5A;类型:一体成型电感;; LCSC Part Name: 4.7uH ±20% 5A; Supplier Part: C181722; Manufacturer: SXN(顺翔诺); Supplier Footprint: SMD; Datasheet: https://atta.szlcsc.com/upload/public/pdf/source/20210810/BBF24330FB2F5029F637830BA9C42C0D.pdf; Supplier: LCSC; Tolerance: ±20%; Rated Current: 4.5A; Saturation Current (Isat): 5A; DC Resistance (DCR): 60mΩ; Type: 一体成型电感
PR3 = 4D03WGF220JT5E: 电阻器数:4;阻值:22Ω;精度:±1%;; LCSC Part Name: 22Ω ±1%; Supplier Part: C414563; Manufacturer: UNI-ROYAL(厚声); Supplier Footprint: 0603x4; JLCPCB Part Class: 扩展库; Datasheet: https://atta.szlcsc.com/upload/public/pdf/source/20191224/C474318_2527498AE30E813171187CCD28401A71.pdf; Supplier: LCSC; Number of Resistors: 4; Tolerance: ±1%; Number of Pins: 8
Q1 = SI2323DS-T1-E3-MS: 类型:1个P沟道;漏源电压(Vdss):20V;连续漏极电流(Id):4.5A;功率(Pd):1.56W;导通电阻(RDS(on)@Vgs,Id):40mΩ@4.5V,4A;阈值电压(Vgs(th)@Id):1V@250uA;; LCSC Part Name: 1个P沟道 耐压:20V 电流:4.5A; Supplier Part: C5343295; Manufacturer: MSKSEMI(美森科); Supplier Footprint: SOT-23; Datasheet: https://atta.szlcsc.com/upload/public/pdf/source/20221229/D1439E151E65D27BC958FB6CF857ED61.pdf; Supplier: LCSC; Type: 1个P沟道; Drain Source Voltage (Vdss): 20V; Continuous Drain Current (Id): 4.5A; Power Dissipation (Pd): 1.56W; Drain Source On Resistance (RDS(on)@Vgs,Id): 40mΩ@4.5V,4A; Gate Threshold Voltage (Vgs(th)@Id): 1V@250uA
R1 = RTT034423FTP: 电阻类型:厚膜电阻;阻值:442kΩ;精度:±1%;功率:100mW;最大工作电压:75V;温度系数:±100ppm/℃;; LCSC Part Name: 厚膜电阻 442kΩ ±1% 100mW; Supplier Part: C103646; Manufacturer: RALEC(旺诠); Supplier Footprint: 0603; JLCPCB Part Class: 扩展库; Datasheet: https://atta.szlcsc.com/upload/public/pdf/source/20191219/C158410_884373A5B7E1BC76BF57BC45A946C093.pdf; Supplier: LCSC; Type: 厚膜电阻; Tolerance: ±1%; Power(Watts): 100mW; Overload Voltage (Max): 75V; Temperature Coefficient: ±100ppm/℃; Operating Temperature Range: -55℃~+155℃
R2 = ERJP03F5602V: 电阻类型:厚膜电阻;阻值:56kΩ;精度:±1%;功率:200mW;最大工作电压:-;温度系数:±200ppm/℃;; LCSC Part Name: 56kΩ ±1% 200mW 厚膜电阻; Supplier Part: C441870; Manufacturer: PANASONIC(松下); Supplier Footprint: 0603; JLCPCB Part Class: 扩展库; Datasheet: https://atta.szlcsc.com/upload/public/pdf/source/20240408/2777E918777E6D004CDB37FF2781F9C2.pdf; Supplier: LCSC; Type: 厚膜电阻; Tolerance: ±1%; Power(Watts): 200mW; Temperature Coefficient: ±200ppm/℃; Operating Temperature Range: -55℃~+155℃
R3 = 0603WAF3303T5E: 电阻类型:厚膜电阻;阻值:330kΩ;精度:±1%;功率:100mW;最大工作电压:75V;温度系数:±100ppm/℃;; LCSC Part Name: 330kΩ ±1% 100mW 厚膜电阻; Supplier Part: C23137; Manufacturer: UNI-ROYAL(厚声); Supplier Footprint: 0603; JLCPCB Part Class: 基础库; Datasheet: https://atta.szlcsc.com/upload/public/pdf/source/20200306/C422600_1E6D84923E4A46A82E41ADD87F860B5C.pdf; Supplier: LCSC; Type: 厚膜电阻; Tolerance: ±1%; Power(Watts): 100mW; Overload Voltage (Max): 75V; Temperature Coefficient: ±100ppm/℃; Operating Temperature Range: -55℃~+155℃
R5 = 0603WAF1000T5E: 电阻类型:厚膜电阻;阻值:100Ω;精度:±1%;功率:100mW;最大工作电压:75V;温度系数:±200ppm/℃;; LCSC Part Name: 100Ω ±1% 100mW 厚膜电阻; Supplier Part: C22775; Manufacturer: UNI-ROYAL(厚声); Supplier Footprint: 0603; JLCPCB Part Class: 基础库; Datasheet: https://atta.szlcsc.com/upload/public/pdf/source/20200306/C422600_1E6D84923E4A46A82E41ADD87F860B5C.pdf; Supplier: LCSC; Type: 厚膜电阻; Tolerance: ±1%; Power(Watts): 100mW; Overload Voltage (Max): 75V; Temperature Coefficient: ±200ppm/℃; Operating Temperature Range: -55℃~+155℃
R21 = 0603WAF1003T5E: 电阻类型:厚膜电阻;阻值:100kΩ;精度:±1%;功率:100mW;最大工作电压:75V;温度系数:±100ppm/℃;; LCSC Part Name: 100kΩ ±1% 100mW 厚膜电阻; Supplier Part: C25803; Manufacturer: UNI-ROYAL(厚声); Supplier Footprint: 0603; JLCPCB Part Class: 基础库; Datasheet: https://atta.szlcsc.com/upload/public/pdf/source/20200306/C422600_1E6D84923E4A46A82E41ADD87F860B5C.pdf; Supplier: LCSC; Type: 厚膜电阻; Tolerance: ±1%; Power(Watts): 100mW; Overload Voltage (Max): 75V; Temperature Coefficient: ±100ppm/℃; Operating Temperature Range: -55℃~+155℃
R22 = 0603WAF3243T5E: 电阻类型:厚膜电阻;阻值:324kΩ;精度:±1%;功率:100mW;最大工作电压:75V;温度系数:±100ppm/℃;; LCSC Part Name: 324kΩ ±1% 100mW 厚膜电阻; Supplier Part: C246851; Manufacturer: UNI-ROYAL(厚声); Supplier Footprint: 0603; JLCPCB Part Class: 扩展库; Datasheet: https://atta.szlcsc.com/upload/public/pdf/source/20200306/C422600_1E6D84923E4A46A82E41ADD87F860B5C.pdf; Supplier: LCSC; Type: 厚膜电阻; Tolerance: ±1%; Power(Watts): 100mW; Overload Voltage (Max): 75V; Temperature Coefficient: ±100ppm/℃; Operating Temperature Range: -55℃~+155℃
R30 = 0603WAF1803T5E: 电阻类型:厚膜电阻;阻值:180kΩ;精度:±1%;功率:100mW;最大工作电压:75V;温度系数:±100ppm/℃;; LCSC Part Name: 180kΩ ±1% 100mW 厚膜电阻; Supplier Part: C22827; Manufacturer: UNI-ROYAL(厚声); Supplier Footprint: 0603; JLCPCB Part Class: 扩展库; Datasheet: https://atta.szlcsc.com/upload/public/pdf/source/20200306/C422600_1E6D84923E4A46A82E41ADD87F860B5C.pdf; Supplier: LCSC; Type: 厚膜电阻; Tolerance: ±1%; Power(Watts): 100mW; Overload Voltage (Max): 75V; Temperature Coefficient: ±100ppm/℃; Operating Temperature Range: -55℃~+155℃
R55 = CRCW060351K1FKEA: 电阻类型:厚膜电阻;阻值:51.1kΩ;精度:±1%;功率:100mW;温度系数:±100ppm/℃;; LCSC Part Name: 厚膜电阻 51.1kΩ ±1% 100mW; Supplier Part: C844575; Manufacturer: VISHAY(威世); Supplier Footprint: 0603; JLCPCB Part Class: 扩展库; Datasheet: https://atta.szlcsc.com/upload/public/pdf/source/20221018/57062C89AB464F61DB643BD1D086C581.pdf; Supplier: LCSC; Type: 厚膜电阻; Tolerance: ±1%; Power(Watts): 100mW; Temperature Coefficient: ±100ppm/℃; Operating Temperature Range: -55℃~+155℃
SCREW1 SCREW2 = M2螺丝: Supplier Footprint: 插件
SCREW3-SCREW6 = M3螺丝: Supplier Footprint: 插件
U1 = TPS65131RGER: 功能类型:升压型；升降压型;输出类型:可调;输入电压:2.7V~5.5V;输出电压:±15V;输出电流(最大值):1.8A;; Supplier Part: C87663; Manufacturer: TI(德州仪器); Supplier Footprint: QFN-24-EP(4x4); JLCPCB Part Class: 扩展库; Datasheet: https://www.ti.com/cn/lit/gpn/tps65130; Supplier: LCSC; Function: 升压型；升降压型; Output Type: 可调; Input Voltage: 2.7V~5.5V; Output Voltage: ±15V; Output Current (Max): 1.8A; Switching Frequency: 1.38MHz; Operating Temperature: -40℃~+85℃@(TA); Synchronous Rectification: 否; Number of Outputs: 2; Topology: 升压式；降压-升压式; Switch tube (built-in/external): 内置
U2 = TPS7A3001DGNR: 输出类型:可调;最大输入电压:35V;输出电压:1.18V~33V;输出电流:200mA;电源纹波抑制比(PSRR):72dB@(120Hz);输出极性:负极;; LCSC Part Name: 具有使能功能的 200mA、低噪声、高 PSRR、负电压、可调节低压降稳压器; Supplier Part: C33835; Manufacturer: TI(德州仪器); Supplier Footprint: HVSSOP-8; JLCPCB Part Class: 扩展库; Datasheet: https://www.ti.com/cn/lit/gpn/tps7a30; Supplier: LCSC; Output Type: 可调; Maximum Input Voltage: 35V; Output Voltage: 1.18V~33V; Output Current: 200mA; Power Supply Rejection Ratio (PSRR): 72dB@(120Hz); Dropout Voltage: 600mV@(200mA); standby current: 100uA; Feature: 防静电保护；低ESR；热保护(TSD)；过流保护(OCP)；带使能; Operating Temperature: -40℃~+125℃; Output Polarity: 负极; Number of Outputs: 1
U3 = 78M06: 输出类型:固定;最大输入电压:35V;输出电压:6V;最大输出电流:500mA;电源纹波抑制比(PSRR):75dB@(120Hz);输出极性:正极;; LCSC Part Name: 输入35V 输出6V 500mA; Supplier Part: C130893; Manufacturer: SHIKUES(时科); Supplier Footprint: TO-252-2(DPAK); JLCPCB Part Class: 扩展库; Datasheet: https://atta.szlcsc.com/upload/public/pdf/source/20170918/C130893_1505703444484975400.pdf; Supplier: LCSC; Output Type: 固定; Maximum Input Voltage: 35V; Output Voltage: 6V; MAX Output Current: 500mA; Power Supply Rejection Ratio (PSRR): 75dB@(120Hz); Dropout Voltage: 2V@(500mA); Output Polarity: 正极; Number of Outputs: 1
U4 = LT1935ES5#TRPBF: 功能类型:升压型；升降压型;输出类型:可调;输入电压:2.3V~16V;输出电压:1.265V~38V;输出电流(最大值):2A;; Supplier Part: C665571; Manufacturer: ADI(亚德诺); Supplier Footprint: TSOT-23-5; JLCPCB Part Class: 扩展库; Datasheet: https://atta.szlcsc.com/upload/public/pdf/source/20170413/1492062800981.pdf; Supplier: LCSC; Function: 升压型；升降压型; Output Type: 可调; Input Voltage: 2.3V~16V; Output Voltage: 1.265V~38V; Output Current (Max): 2A; Switching Frequency: 1.2MHz; Operating Temperature: 0℃~+70℃@(TA); Synchronous Rectification: 否; Number of Outputs: 1; Topology: 反激式；SEPIC；升压式; Switch tube (built-in/external): 内置
U47 = AD9826KRSZRL: 完整的16位成像信号处理器; LCSC Part Name: AD9826KRSZ; Supplier Part: C13734; Manufacturer: ADI(亚德诺); Supplier Footprint: SSOP-28-208mil; JLCPCB Part Class: 扩展库; Datasheet: https://atta.szlcsc.com/upload/public/pdf/source/20180326/C13734_10B6C3E6990DCAEEB2DFEDB3C3E1F24A.pdf; Supplier: LCSC
ZD1 ZD2 = BZT52C15_C2104: 二极管配置:独立式;稳压值(标称值):15V;稳压值(范围):13.8V~15.6V;功率:350mW;精度:-;; Supplier Part: C2104; Manufacturer: CJ(江苏长电/长晶); Supplier Footprint: SOD-123; JLCPCB Part Class: 扩展库; Datasheet: https://atta.szlcsc.com/upload/public/pdf/source/20140508/1457707057629.pdf; Supplier: LCSC; Diode Configuration: 独立式; Zener Voltage (Nom): 15V; Reverse Leakage Current (Ir): 100nA@10.5V; Zener Voltage (Range): 13.8V~15.6V; Power Dissipation: 350mW; Zener Impedance (Zzt): 30Ω

## Nets
+3.3V: C72.1 C73.2 C74.2 C86.2 C87.1 C101.1 FPC1.4 FPC1.6 H7.2 R42.1 U27.15(PVINS) U27.16(PVINL) U47.5(DRVDD)
+5V: C2.2 C20.2 C31.2 C98.2 C99.2 C100.1 C117.1 H1.2 J1.3 L3.2 Q1.2(S) R5.1 R26.1 U1.5(INN) U1.6(INN) U1.8(ENP) U1.9(PSP) U1.10(ENN) U1.11(PSN) U4.5(VIN) U47.18(AVDD) U47.28(AVDD)
+6V_D: C29.1 C55.2 C56.2 C63.2 C67.2 C68.2 C103.2 C105.1 C107.1 C109.1 C111.1 R31.2 U3.3(OUT) U16.6(VS) U19.12(VH) U19.16(VS+) U22.6(VS) U25.6(VS)
+12V_D: C4.1 C5.1 C6.1 C11.1 C18.2 C28.2 C118.1 C119.1 C120.1 C121.1 C122.1 C123.1 D1.1(C) J1.6 J2.1 J2.2 J2.3 J2.4 J2.6 R1.2 R55.2 U1.23(VPOS) U3.1(IN) ZD1.1(K)
+24V_D: C33.1 C34.2 C35.1 C116.1 D4.1(C) J1.2 Q2.3 R30.1 R53.2
-5V_D: C26.1 C27.2 C51.2 C52.2 C54.2 C66.2 C102.1 C104.1 C108.1 C110.1 D3.2(A) R23.2 R62.1 R64.2 U16.3(GND) U19.4(VL) U19.9(VS) U25.3(GND)
-8V_D: C10.2 C12.1 C13.1 C14.1 C15.1 C19.2 C21.2 C22.2 C62.2 C106.1 C112.1 C113.1 C114.1 C115.1 D2.2(A) J1.13 J1.14 J2.9 J2.10 R3.2 R63.1 U1.15(VNEG) U2.5(EN) U2.8(IN) U22.3(GND) ZD2.2(A)
AGND: C1.2 C2.1 C3.1 C4.2 C5.2 C6.2 C7.2 C8.1 C11.2 C12.2 C13.2 C14.2 C15.2 C16.2 C18.1 C19.1 C20.1 C21.1 C22.1 C24.1 C25.1 C26.2 C27.1 C28.1 C29.2 C30.2 C31.1 C34.1 C35.2 C44.1 C45.1 C46.1 C47.1 C48.2 C49.1 C51.1 C52.1 C54.1 C55.1 C56.1 C60.1 C61.2 C62.1 C63.1 C65.2 C66.1 C67.1 C68.1 C69.2 C71.2 C73.1 C74.1 C76.2 C77.2 C78.2 C79.2 C86.1 C87.2 C88.1 C89.1 C91.1 C92.1 C94.1 C95.2 C96.1 C98.1 C99.1 C100.2 C101.2 C102.2 C103.1 C104.2 C105.2 C106.2 C107.2 C108.2 C109.2 C110.2 C111.2 C112.2 C113.2 C114.2 C115.2 C116.2 C117.2 C118.2 C119.2 C120.2 C121.2 C122.2 C123.2 D3.1(K) FPC1.2 FPC1.32 FPC1.33 H1.1 H7.1 J1.5 J2.5 L2.2 L5.2 L6.2 R2.1 R21.1 R29.2 R44.2 R46.1 R49.1 R50.2 R54.1 R60.2 R61.2 R65.1 R66.1 SCREW1.1 SCREW2.1 SCREW3.1 SCREW4.1 SCREW5.1 SCREW6.1 U1.19(AGND) U2.4(GND) U2.9(EP) U3.2(GND) U4.2(GND) U19.5(GND) U27.7(AGND) U27.25(EP) U28.5(GND) U47.4(OEB) U47.6(DRVSS) U47.19(AVSS) U47.27(AVSS) U48.3(GND) ZD1.2(A) ZD2.1(K)
GND: C72.2 L5.1 L6.1 U1.2(PGND) U1.3(PGND) U1.25(EP) U27.12(PGNDS) U27.13(PGNDS) U27.18(PGNDL) U27.19(PGNDL)
P1V: J2.12 R39.2
P2V: J2.11 J2.13 R38.2
AD_ADCCLK: PR3.5 U47.3(ADCCLK)
AD_ADCCLK_I: FPC1.5 PR3.4
AD_CDSCLK1: PR3.7 U47.1(CDSCLK1)
AD_CDSCLK1_I: FPC1.1 PR3.2
AD_CDSCLK2: PR3.6 U47.2(CDSCLK2)
AD_CDSCLK2_I: FPC1.3 PR3.3
ADC0_CCD_TH: R47.1 R48.1 U48.4(AIN0)
ADC1_VTEC: U27.9(VTEC) U48.5(AIN1)
ADC2_ITEC: U27.11(ITEC) U48.6(AIN2)
ADC3_ENV: R51.1 R52.1 U48.7(AIN3)
ADN8833_EN: FPC1.27 U27.8(EN/SY)
CAPB: C90.1 C92.2 C93.2 U47.20(CAPB)
CAPT: C90.2 C91.2 C93.1 U47.21(CAPT)
CCD_IN: C97.1 U47.26(VINR)
CCD_P+: C71.1 J2.7 U27.17(LDR)
CCD_P-: C69.1 J1.8 L4.2 R41.1
CCD_TH1: J1.7 R48.2
CCD_TH2: J2.8 R49.2
CML: C94.2 U47.23(CML)
D0: FPC1.9 U47.14(/LSBD0)
D1: FPC1.11 U47.13(D1)
D2: FPC1.13 U47.12(D2)
D3: FPC1.15 U47.11(D3)
D4: FPC1.17 U47.10(D4)
D5: FPC1.19 U47.9(D5)
D6: FPC1.21 U47.8(D6)
D7: FPC1.23 U47.7(/MSBD7)
DAC0: U27.2(CONT) U28.6(VOUT)
ILIM: R45.2 R46.2 U27.4(ILIM)
IP1H: FPC1.12 U19.8(IND)
IP1V: C128.2 FPC1.16
IP1V_8V: C128.1 R58.2 U22.4(INB)
IP2H: FPC1.14 U19.7(INC)
IP2V: C129.2 FPC1.18
IP2V_8V: C129.1 R59.2 U22.2(INA)
IP3H: FPC1.8 U19.3(INB)
IP4H: C126.2 FPC1.10 U19.1(INA)
IP4H_5V: C126.1 R56.2 U16.2(INA) U16.4(INB)
IRG: C127.2 FPC1.20
IRG_5V: C127.1 R57.2 U25.2(INA) U25.4(INB)
OFFSET: C95.1 C96.2 U47.25(OFFSET)
OS: C130.2 J1.1 R66.2
P1H: J1.12 R35.2
P2H: J1.11 R33.2
P3H: J1.10 R32.2
P4H: J1.9 R34.2
RG: J2.14 R40.2 R70.1
SG: J1.4 R36.2 R37.2
SPI_AD9826_CS: FPC1.31 U47.17(SLOAD)
SPI_ADC0_CS: FPC1.29 U48.2(/CS)
SPI_CLK: FPC1.24 U28.2(SCLK) U47.16(SCLK) U48.1(SCLK)
SPI_DAC_CS: FPC1.30 U28.1(SYNC#)
SPI_MISO: FPC1.25 U48.9(DOUT/DRDY)
SPI_MOSI: FPC1.22 U28.3(DIN) U47.15(SDATA) U48.10(DIN)
VLIM: R43.2 R44.1 U27.3(VLIM/SD)
VREF_2.5V: C76.1 C77.1 C78.1 C79.1 R43.1 R45.1 R47.2 R52.2 U27.6(VREF) U28.4(AVDD/VREF) U48.8(VDD)
$1N2699: C1.1 R5.2 U1.4(VIN)
$1N2998: D1.2(A) L1.2 U1.1(INP) U1.24(INP)
$1N3163: C9.1 R1.1 R2.2 U1.22(FBP)
$1N3544: D2.1(C) L2.1 U1.13(OUTN) U1.14(OUTN)
$1N3762: C16.1 U1.21(CP)
$1N3934: C7.1 U1.18(CN)
$1N5062: C23.2 C25.2 R22.2 R23.1 U2.1(OUT)
$1N5080: C23.1 R21.2 R22.1 U2.2(FB)
$1N5164: C24.2 U2.6(NRSS)
$1N6498: C30.1 R26.2 U4.4(SHDN#)
$1N6777: D4.2(A) L3.1 U4.1(SW)
$1N7221: C33.2 R29.1 R30.2 U4.3(FB)
$1N8780: C88.2 U47.24(VING)
$1N8816: C89.2 U47.22(VINB)
$1N19808: C3.2 L1.1 Q1.3(D)
$1N19938: Q1.1(G) U1.7(BSW)
$1N20623: C8.2 R4.2 U1.17(VREF)
$1N21010: C10.1 R3.1 R4.1 U1.16(FBN)
$1N25931: C9.2 R55.1
$1N29689: R56.1 R60.1 R62.2
$1N29716: R58.1 R59.1 R61.1 R63.2
$1N35262: R57.1 R64.1 R65.2
$2N2065: C48.1 R36.1 U16.7(OUTA)
$2N2069: C44.2 R37.1 U16.5(OUTB)
$2N2493: C61.1 R38.1 U22.7(OUTA)
$2N2979: C47.2 R33.1 U19.11(OUTC)
$2N3219: R31.1 U19.2(OE)
$2N3340: C49.2 R32.1 U19.14(OUTB)
$2N3619: C45.2 R34.1 U19.15(OUTA)
$2N3658: C46.2 R35.1 U19.10(OUTD)
$2N3941: C60.2 R39.1 U22.5(OUTB)
$2N4355: L4.1 U27.14(SW)
$2N4879: R42.2 U27.5(VDD)
$2N9003: C97.2 Q2.2 R54.2
$2N9069: C130.1 Q2.1 R53.1
$2N35733: R50.1 R51.2
$2N49859: R70.2 U25.5(OUTB)
$2N49860: C65.1 R40.1 U25.7(OUTA)
$2N49964: R41.2 U27.10(SFB)

Not connected (* = marked no-connect by the designer): FPC1 7* 26* 28*; PR3 1* 8*; U1 12(NC)* 20(NC)*; U2 3(NC)* 7(DNC)*; U16 1(NC)* 8(NC)*; U19 6(NC)* 13(NC)*; U22 1(NC)* 8(NC)*; U25 1(NC)* 8(NC)*; U27 1(DNC)* 20(DNC)* 21(DNC)* 22(DNC)* 23(DNC)* 24(DNC)*

## Notes on the sheets
sheet 1
- +5V转+12V/-8V
- -8V转-5V
- +12V转+6V
- +5V转+24V
- Vout=1.265(1+R30/R29)
